# Altium schematic sheet MergeRev4_0.SchDoc
size A
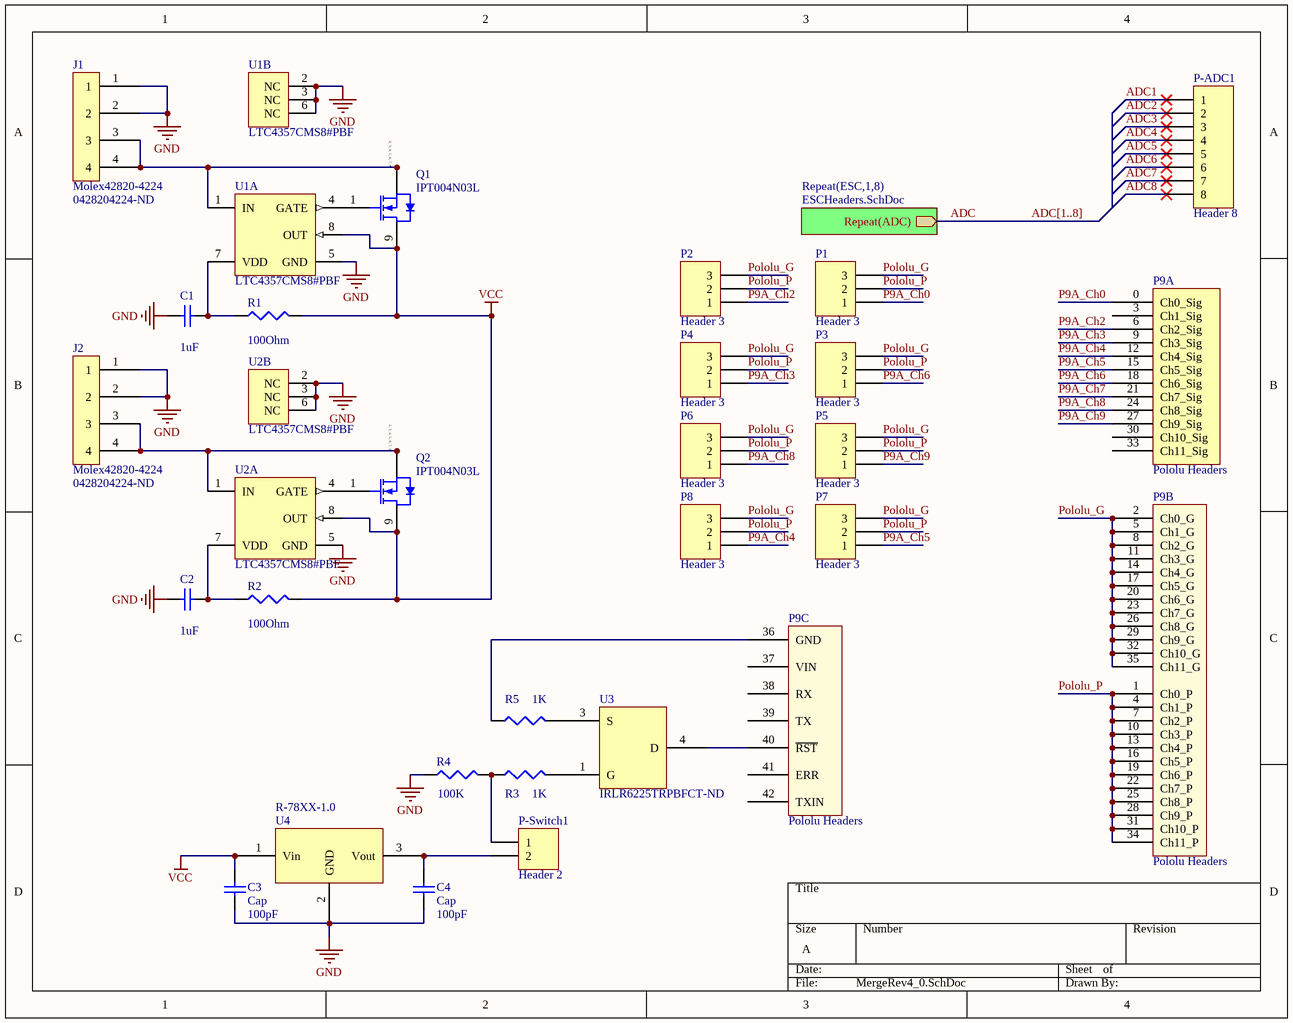
[diagram p0: MergeRev4_0.SchDoc]

## Parts
C1  value 1uF  [C1206]  (hidden comment: Cap Semi)
C2  value 1uF  [C1206]  (hidden comment: Cap Semi)
C3  Cap  value 100pF  [1608[0603]]
C4  Cap  value 100pF  [1608[0603]]
J1  Molex42820-4224  Supplier Part Number 1: 0428204224-ND  [Molex42820-4224]
J2  Molex42820-4224  Supplier Part Number 1: 0428204224-ND  [Molex42820-4224]
P1  Header 3  [HDR1X3]
P2  Header 3  [HDR1X3]
P3  Header 3  [HDR1X3]
P4  Header 3  [HDR1X3]
P5  Header 3  [HDR1X3]
P6  Header 3  [HDR1X3]
P7  Header 3  [HDR1X3]
P8  Header 3  [HDR1X3]
P9  Pololu Headers  [Pololu Headers]  (parts A,B,C of 3)
P-ADC1  Header 8  [HDR1X8]
P-Switch1  Header 2  [HDR1X2]
Q1  IPT004N03L  [INF-PG-HSOF-8-1_V]
Q2  IPT004N03L  [INF-PG-HSOF-8-1_V]
R1  value 100Ohm  [J1-0603]  (hidden comment: Res3)
R2  value 100Ohm  [J1-0603]  (hidden comment: Res3)
R3  value 1K  [J1-0603]  (hidden comment: Res3)
R4  value 100K  [J1-0603]  (hidden comment: Res3)
R5  value 1K  [J1-0603]  (hidden comment: Res3)
U1  LTC4357CMS8#PBF  [LT-MS8-8_N]  (parts A,B of 2)
U2  LTC4357CMS8#PBF  [LT-MS8-8_N]  (parts A,B of 2)
U3  IRLR6225TRPBFCT-ND  [IRLR6225_DT]
U4  R-78XX-1.0  [R-785.0-1.0]

## Sub-sheets
Repeat(ESC,1,8) = ESCHeaders.SchDoc: Repeat(ADC) (out)

## Nets
GND: C1.1 C2.1 C3.1 C4.1 J1.1 J1.2 J2.1 J2.2 R4.1 U1.2(NC) U1.3(NC) U1.5(GND) U1.6(NC) U2.2(NC) U2.3(NC) U2.5(GND) U2.6(NC) U4.2(GND)
VCC: C3.2 Q1.9(D) Q2.9(D) R1.2 R2.2 U1.8(OUT) U2.8(OUT) U4.1(Vin)
ADC: sheet Repeat(ESC,1,8)/Repeat(ADC)
ADC1: P-ADC1.1
ADC2: P-ADC1.2
ADC3: P-ADC1.3
ADC4: P-ADC1.4
ADC5: P-ADC1.5
ADC6: P-ADC1.6
ADC7: P-ADC1.7
ADC8: P-ADC1.8
P9A_Ch0: P1.1 P9.0(Ch0_Sig)
P9A_Ch2: P2.1 P9.6(Ch2_Sig)
P9A_Ch3: P4.1 P9.9(Ch3_Sig)
P9A_Ch4: P8.1 P9.12(Ch4_Sig)
P9A_Ch5: P7.1 P9.15(Ch5_Sig)
P9A_Ch6: P3.1 P9.18(Ch6_Sig)
P9A_Ch7: P9.21(Ch7_Sig)
P9A_Ch8: P6.1 P9.24(Ch8_Sig)
P9A_Ch9: P5.1 P9.27(Ch9_Sig)
Pololu_G: P1.3 P2.3 P3.3 P4.3 P5.3 P6.3 P7.3 P8.3 P9.2(Ch0_G) P9.5(Ch1_G) P9.8(Ch2_G) P9.11(Ch3_G) P9.14(Ch4_G) P9.17(Ch5_G) P9.20(Ch6_G) P9.23(Ch7_G) P9.26(Ch8_G) P9.29(Ch9_G) P9.32(Ch10_G) P9.35(Ch11_G)
Pololu_P: P1.2 P2.2 P3.2 P4.2 P5.2 P6.2 P7.2 P8.2 P9.1(Ch0_P) P9.4(Ch1_P) P9.7(Ch2_P) P9.10(Ch3_P) P9.13(Ch4_P) P9.16(Ch5_P) P9.19(Ch6_P) P9.22(Ch7_P) P9.25(Ch8_P) P9.28(Ch9_P) P9.31(Ch10_P) P9.34(Ch11_P)
NetC1_2: C1.2 R1.1 U1.7(VDD)
NetC2_2: C2.2 R2.1 U2.7(VDD)
NetC4_2: C4.2 P-Switch1.2 U4.3(Vout)
NetJ1_3: J1.3 J1.4 Q1.2(S) Q1.3(S) Q1.4(S) Q1.5(S) Q1.6(S) Q1.7(S) Q1.8(S) U1.1(IN)
NetJ2_3: J2.3 J2.4 Q2.2(S) Q2.3(S) Q2.4(S) Q2.5(S) Q2.6(S) Q2.7(S) Q2.8(S) U2.1(IN)
NetP9_36: P9.36(GND) R5.1
NetP9_40: P9.40(~{RST}) U3.4(D)
NetP-Switch1_1: P-Switch1.1 R3.1 R4.2
NetQ1_1: Q1.1(GATE) U1.4(GATE)
NetQ2_1: Q2.1(GATE) U2.4(GATE)
NetR3_2: R3.2 U3.1(G)
NetR5_2: R5.2 U3.3(S)

Not connected (* = marked no-connect by the designer): P9 3(Ch1_Sig) 30(Ch10_Sig) 33(Ch11_Sig) 37(VIN) 38(RX) 39(TX) 41(ERR) 42(TXIN)

## Buses and harness runs
bus ADC[1..8]

## Notes on the sheet
- (in symbol IPT004N03L) 2, 3, 4, 5, 6, 7, 8

## Library data of the parts
C1 C2 = Cap Semi: Capacitor (Semiconductor SIM Model); Published: 8-Jun-2000; LatestRevisionDate: 29-May-2009; LatestRevisionNote: IPC-7351 Footprint Added.; PackageReference: C1206; Publisher: Altium Limited; PackageDescription: Chip Capacitor
C3 C4 = Cap: Capacitor; Published: 8-Jun-2000; LatestRevisionDate: 17-Jul-2002; LatestRevisionNote: Re-released for DXP Platform.; PackageReference: RAD-0.3; Publisher: Altium Limited; PackageDescription: Radial Cap, Thru-Hole; 2 Leads; 0.3 in Pin Spacing
P1-P8 = Header 3: Header, 3-Pin; LatestRevisionDate: 17-Jul-2002; LatestRevisionNote: Re-released for DXP Platform.; Publisher: Altium Limited
P-ADC1 = Header 8: Header, 8-Pin; LatestRevisionDate: 17-Jul-2002; LatestRevisionNote: Re-released for DXP Platform.; Publisher: Altium Limited
P-Switch1 = Header 2: Header, 2-Pin; LatestRevisionDate: 17-Jul-2002; LatestRevisionNote: Re-released for DXP Platform.; Publisher: Altium Limited
Q1 Q2 = IPT004N03L: N-Channel OptiMOS(TM) Power-MOSFET, 30 V VDS, 300 A ID, -55 to 175 degC, PG-HSOF-8, Reel, Green; Manufacturer: Infineon; Green: TRUE; ID (max): 300 A; IDpuls (max): 1,200 A; Polarity: FALSE; Ptot (max): 300 W; QG: 122 nC; RDS (on) (max): 0.4 mOhm; RthJA (max): 40 K/W; RthJC (max): 0.5 K/W; VDS (max): 30 V; VGS(th) (max): 2.2 V; VGS(th) (min): 0.7 V; DatasheetVersion: Rev. 1.2; PackageVersion: Rev. 04; PackageReference: PG-HSOF-8-1; PackageDescription: 8-Pin Plastic (Green) Heatlink Small Outline Flat Leads Package, 10.375 x 9.9 mm Body, 0.8 mm Pitch; Supplier 1: Mouser; Supplier Part Number 1: N/A; Halogen-free: TRUE; Packing: Reel; Technology: OptiMOS(TM); Mounting Technology: Surface Mount; PartNumber: IPT004N03L; ComponentLink1Description: Manufacturer URL; ComponentLink1URL: http://www.infineon.com/; ComponentLink2Description: Datasheet; ComponentLink2URL: http://www.infineon.com/dgdl/IPT004N03L_rev1.2.pdf?folderId=db3a304313b8b5a60113cee8763b02d7&fileId=db3a30433e9d5d11013e9e0f382600c2; ComponentLink3Description: Package Specification; ComponentLink3URL: http://www.infineon.com/cms/packages/SMD_-_Surface_Mounted_Devices/P-PG-HSOF/P-PG-HSOF-08-1.html?__locale=en
R1-R5 = Res3: Resistor; Published: 8-Jun-2000; LatestRevisionDate: 29-May-2009; LatestRevisionNote: IPC-7351 Footprint Added.; PackageReference: J1-0603; Publisher: Altium Limited; PackageDescription: Chip Resistor
U1 U2 = LTC4357CMS8#PBF: Positive High Voltage Ideal Diode Controller, 9 to 80 V Vin, 8-pin SOP (MS8-8), 0 to 70 degC, Pb-Free; Manufacturer: Linear Technology; Ideal Diode: Single, External, N-Channel; DatasheetVersion: Rev. D; PackageVersion: Rev. G, 03/2012; PackageReference: MS8-8; PackageDescription: 8-Pin Plastic MSOP, Body 3 x 3 mm, Pitch 0.65 mm; Supplier 1: Digi-Key; Supplier Part Number 1: LTC4357CMS8#PBF-ND; Supplier 2: Farnell; Supplier Part Number 2: 1432779; Supplier 3: Newark; Supplier Part Number 3: 56M9468; RoHS: TRUE; Mounting Technology: Surface Mount; PartNumber: LTC4357CMS8#PBF; ComponentLink1Description: Manufacturer URL; ComponentLink1URL: http://www.linear.com/; ComponentLink2Description: Datasheet; ComponentLink2URL: http://cds.linear.com/docs/en/datasheet/4357fd.pdf; ComponentLink3Description: Package Specification; ComponentLink3URL: http://cds.linear.com/docs/en/packaging/05081660_G_MS8.pdf
J1 J2 = Molex42820-4224: Supplier 1: Digi-Key; ComponentLink1Description: DataSheet; ComponentLink1URL: https://www.molex.com/pdm_docs/sd/428204224_sd.pdf
U3 = IRLR6225TRPBFCT-ND: mnfr_part_num: IRLR6225TRPBFCT-ND